# EAGLE design sfp_flase (EAGLE 9.3.2)
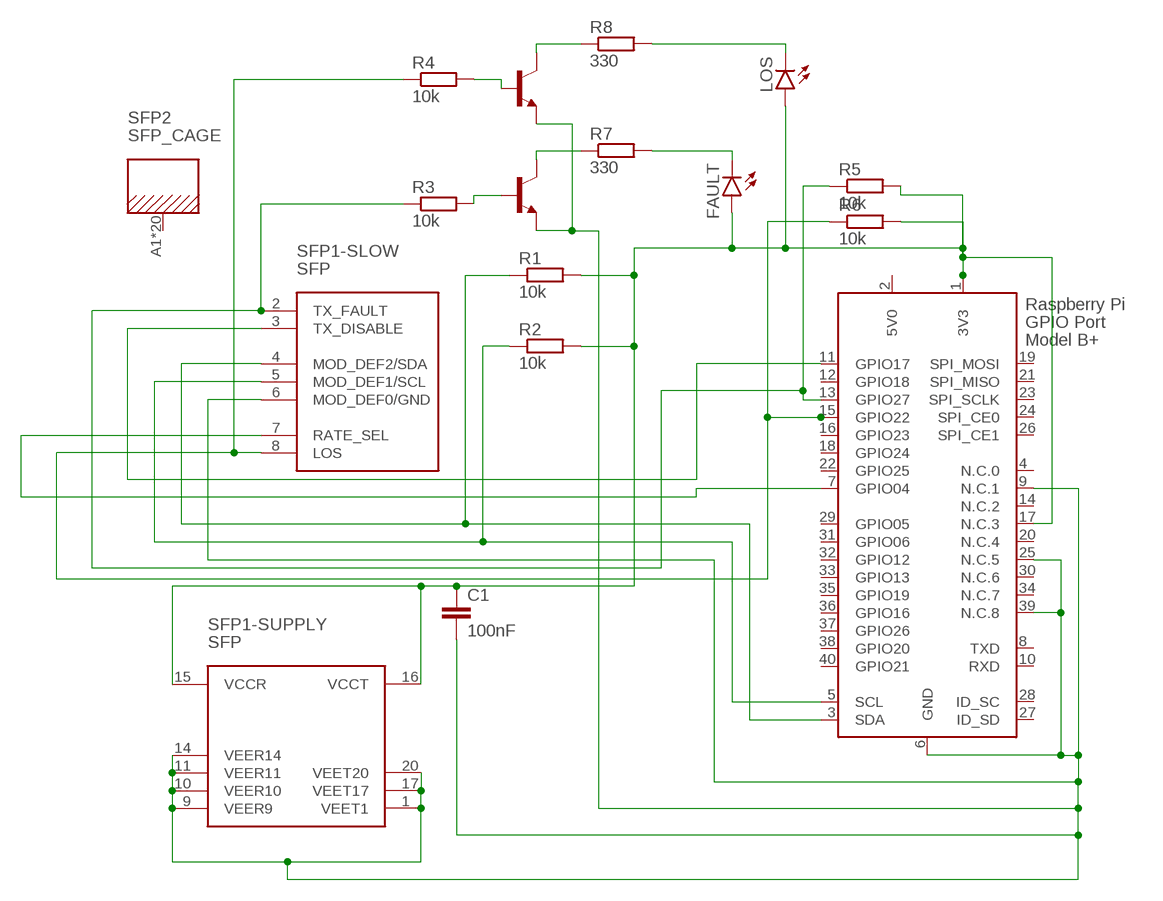
[diagram p0: schematic, sheet 1]

## Parts
C1  100nF  C-EUC1206  [C1206]
FAULT  LEDCHIPLED_1206  [CHIPLED_1206]
LOS  LEDCHIPLED_1206  [CHIPLED_1206]
R1  10k  R-EU_M1206  [M1206]
R2  10k  R-EU_M1206  [M1206]
R3  10k  R-EU_M1206  [M1206]
R4  10k  R-EU_M1206  [M1206]
R5  10k  R-EU_M1206  [M1206]
R6  10k  R-EU_M1206  [M1206]
R7  330  R-EU_M1206  [M1206]
R8  330  R-EU_M1206  [M1206]
SFP1  SFP  [SFP]
SFP2  SFP_CAGE  [SFP_CAGE]
T1  BC847  [SOT23]
T2  BC847  [SOT23]
X1  RASPI_BOARD_B+_E0  [RASPI_BOARD_B+_EDGES_0DRILL]

## Nets
3V3: C1.1 FAULT.A LOS.A R1.2 R2.2 R5.2 R6.2 SFP1.15(-SUPPLY:VCCR) SFP1.16(-SUPPLY:VCCT) X1.1(3V3) X1.17(N.C.3)
GND: C1.2 SFP1.1(-SUPPLY:VEET1) SFP1.6(-SLOW:MOD_DEF0/GND) SFP1.9(-SUPPLY:VEER9) SFP1.10(-SUPPLY:VEER10) SFP1.11(-SUPPLY:VEER11) SFP1.14(-SUPPLY:VEER14) SFP1.17(-SUPPLY:VEET17) SFP1.20(-SUPPLY:VEET20) T1.2(E) T2.2(E) X1.6(GND) X1.9(N.C.1) X1.25(N.C.5) X1.39(N.C.8)
N$1: R2.1 SFP1.5(-SLOW:MOD_DEF1/SCL) X1.5(SCL)
N$2: R1.1 SFP1.4(-SLOW:MOD_DEF2/SDA) X1.3(SDA)
N$3: R3.1 R5.1 SFP1.2(-SLOW:TX_FAULT) X1.13(GPIO27)
N$6: SFP1.3(-SLOW:TX_DISABLE) X1.11(GPIO17)
N$7: R4.2 T1.1(B)
N$8: R3.2 T2.1(B)
N$9: R8.1 T1.3(C)
N$10: R7.1 T2.3(C)
N$11: FAULT.C R7.2
N$12: LOS.C R8.2
N$14: SFP1.7(-SLOW:RATE_SEL) X1.7(GPIO04)
N$16: R4.1 R6.1 SFP1.8(-SLOW:LOS) X1.15(GPIO22)
Unconnected: SFP1.12(-HS:RD_N) SFP1.13(-HS:RD_P) SFP1.18(-HS:TD_P) SFP1.19(-HS:TD_N) X1.4(N.C.0) X1.8(TXD) X1.10(RXD) X1.12(GPIO18) X1.14(N.C.2) X1.16(GPIO23) X1.18(GPIO24) X1.19(SPI_MOSI) X1.20(N.C.4) X1.21(SPI_MISO) X1.22(GPIO25) X1.23(SPI_SCLK) X1.24(SPI_CE0) X1.26(SPI_CE1) X1.27(ID_SD) X1.28(ID_SC) X1.29(GPIO05) X1.30(N.C.6) X1.31(GPIO06) X1.32(GPIO12) X1.33(GPIO13) X1.34(N.C.7) X1.35(GPIO19) X1.36(GPIO16) X1.37(GPIO26) X1.38(GPIO20) X1.40(GPIO21)

## Power pins joined to a net without a drawn wire
5V0: X1.2(5V0)
GND: SFP2.A1(CAGE) SFP2.A2(CAGE) SFP2.A3(CAGE) SFP2.A4(CAGE) SFP2.A5(CAGE) SFP2.A6(CAGE) SFP2.A7(CAGE) SFP2.A8(CAGE) SFP2.A10(CAGE) SFP2.A11(CAGE) SFP2.A12(CAGE) SFP2.B1(CAGE) SFP2.B2(CAGE) SFP2.B3(CAGE) SFP2.B4(CAGE) SFP2.B5(CAGE) SFP2.B6(CAGE) SFP2.B7(CAGE) SFP2.B8(CAGE) SFP2.B10(CAGE)

## Library data of the parts
C1 = rcl:C-EU: CAPACITOR, European symbol; SPICEPREFIX: C
FAULT LOS = led:LED: LED OSRAM: - CHIPLED LG R971, LG N971, LY N971, LG Q971, LY Q971, LO R971, LY R971 LH N974, LH R974 LS Q976, LO Q976, LY Q976 LO Q996 - Hyper CHIPLED LW Q18S LB Q993, LB Q99A, LB R99A - SideLED LS A670, LO A670, LY A670, LG A670, LP A670 LB A673, LV A673, LT A673, LW A673 LH A674 LY A675 LS A676, LA A676, LO A676, LY A676, LW A676 LS A679, LY A679, LG A679 - Hyper Micro SIDELED® LS Y876, LA Y876, LO Y876, LY Y876 LT Y87S - SmartLED LW L88C, LW L88S LB L89C, LB L89S, LG L890 LS L89K, LO L89K, LY L89K LS L896, LA L896, LO L896, LY L896 - TOPLED LS T670, LO T670, LY T670, LG T670, LP T670 LSG T670, LSP T670, LSY T670, LOP T670, LYG T670 LG T671, LOG T671, LSG T671 LB T673, LV T673, LT T673, LW T673 LH T674 LS T676, LA T676, LO T676, LY T676, LB T676, LH T676, LSB T676, LW T676 LB T67C, LV T67C, LT T67C, LS T67K, LO T67K, LY T67K, LW E67C LS E67B, LA E67B, LO E67B, LY E67B, LB E67C, LV E67C, LT E67C LW T67C LS T679, LY T679, LG T679 LS T770, LO T770, LY T770, LG T770, LP T770 LB T773, LV T773, LT T773, LW T773 LH T774 LS E675, LA E675, LY E675, LS T675 LS T776, LA T776, LO T776, LY T776, LB T776 LHGB T686 LT T68C, LB T68C - Hyper Mini TOPLED® LB M676 - Mini TOPLED Santana® LG M470 LS M47K, LO M47K, LY M47K Source: http://www.osram.convergy.de LUXEON: - LUMILED® LXK2-PW12-R00, LXK2-PW12-S00, LXK2-PW14-U00, LXK2-PW14-V00 LXK2-PM12-R00, LXK2-PM12-S00, LXK2-PM14-U00 LXK2-PE12-Q00, LXK2-PE12-R00, LXK2-PE12-S00, LXK2-PE14-T00, LXK2-PE14-U00 LXK2-PB12-K00, LXK2-PB12-L00, LXK2-PB12-M00, LXK2-PB14-N00, LXK2-PB14-P00, LXK2-PB14-Q00 LXK2-PR12-L00, LXK2-PR12-M00, LXK2-PR14-Q00, LXK2-PR14-R00 LXK2-PD12-Q00, LXK2-PD12-R00, LXK2-PD12-S00 LXK2-PH12-R00, LXK2-PH12-S00 LXK2-PL12-P00, LXK2-PL12-Q00, LXK2-PL12-R00 Source: www.luxeon.com KINGBRIGHT: KA-3528ASYC Source: www.kingbright.com
R1-R8 = rcl:R-EU_: RESISTOR, European symbol; SPICEPREFIX: R
SFP1 = sfp:SFP: SFP receptable (Combine with SFP_CAGE for a full SFP setup)
SFP2 = sfp:SFP_CAGE: SFP Cage
T1 T2 = transistor-neu-to92:BC847: NPN TRANSISTOR
X1 = raspberrypi_bastelstube_v13:RASPI_BOARD_B+: Raspberry Pi GPIO connector with markings for the outer dimensions of the Raspberry Pi board model B+ with different sets of drill holes or mounting pads

## Board
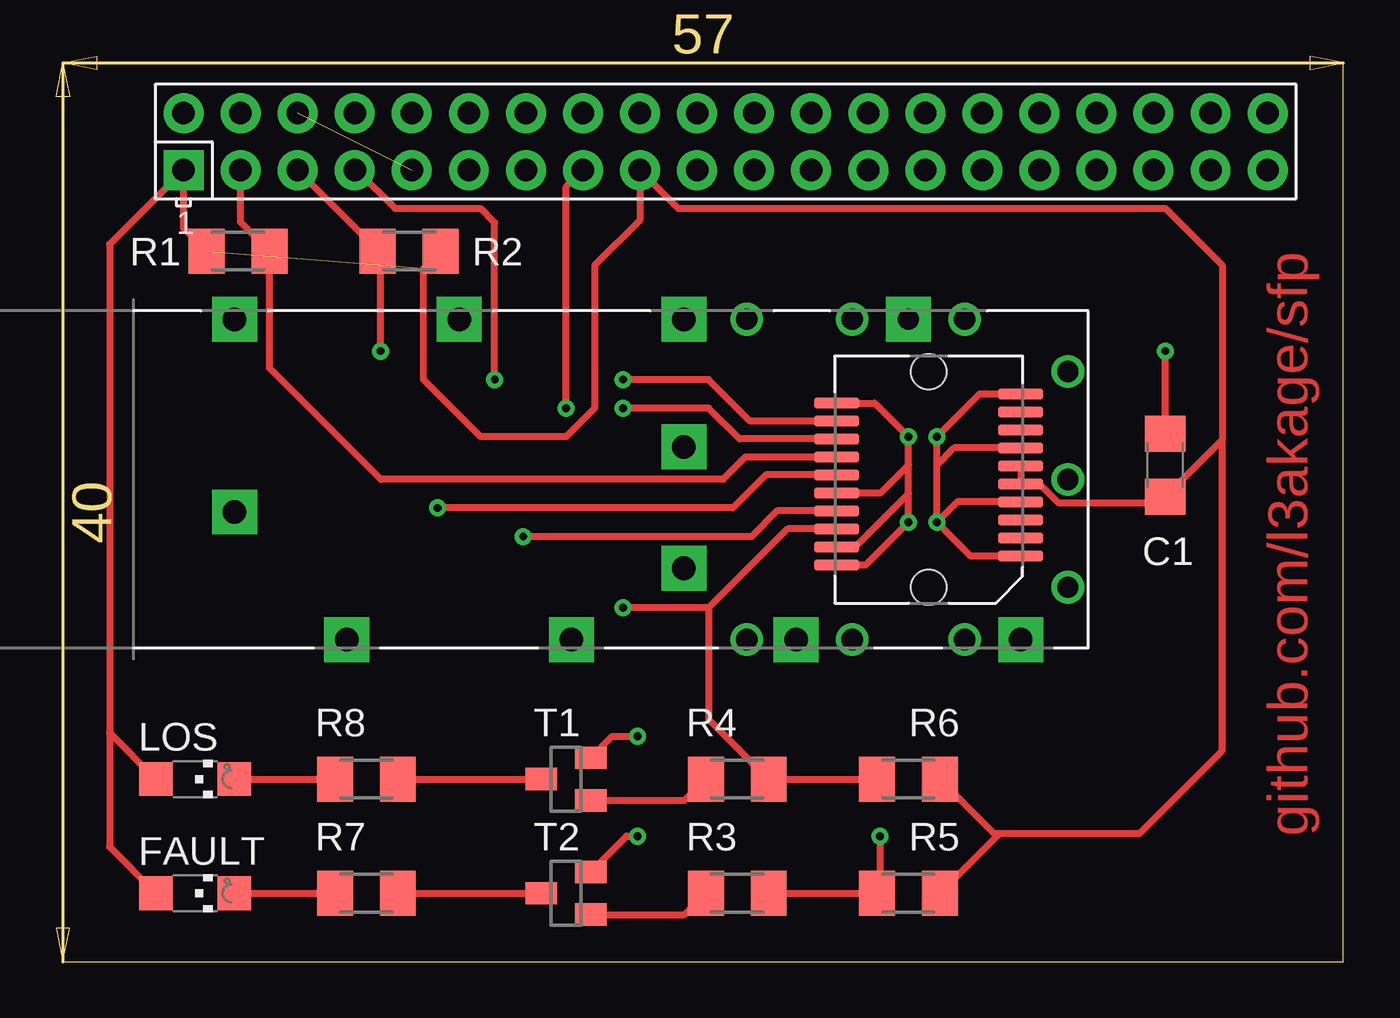
[diagram p1: board, top side]
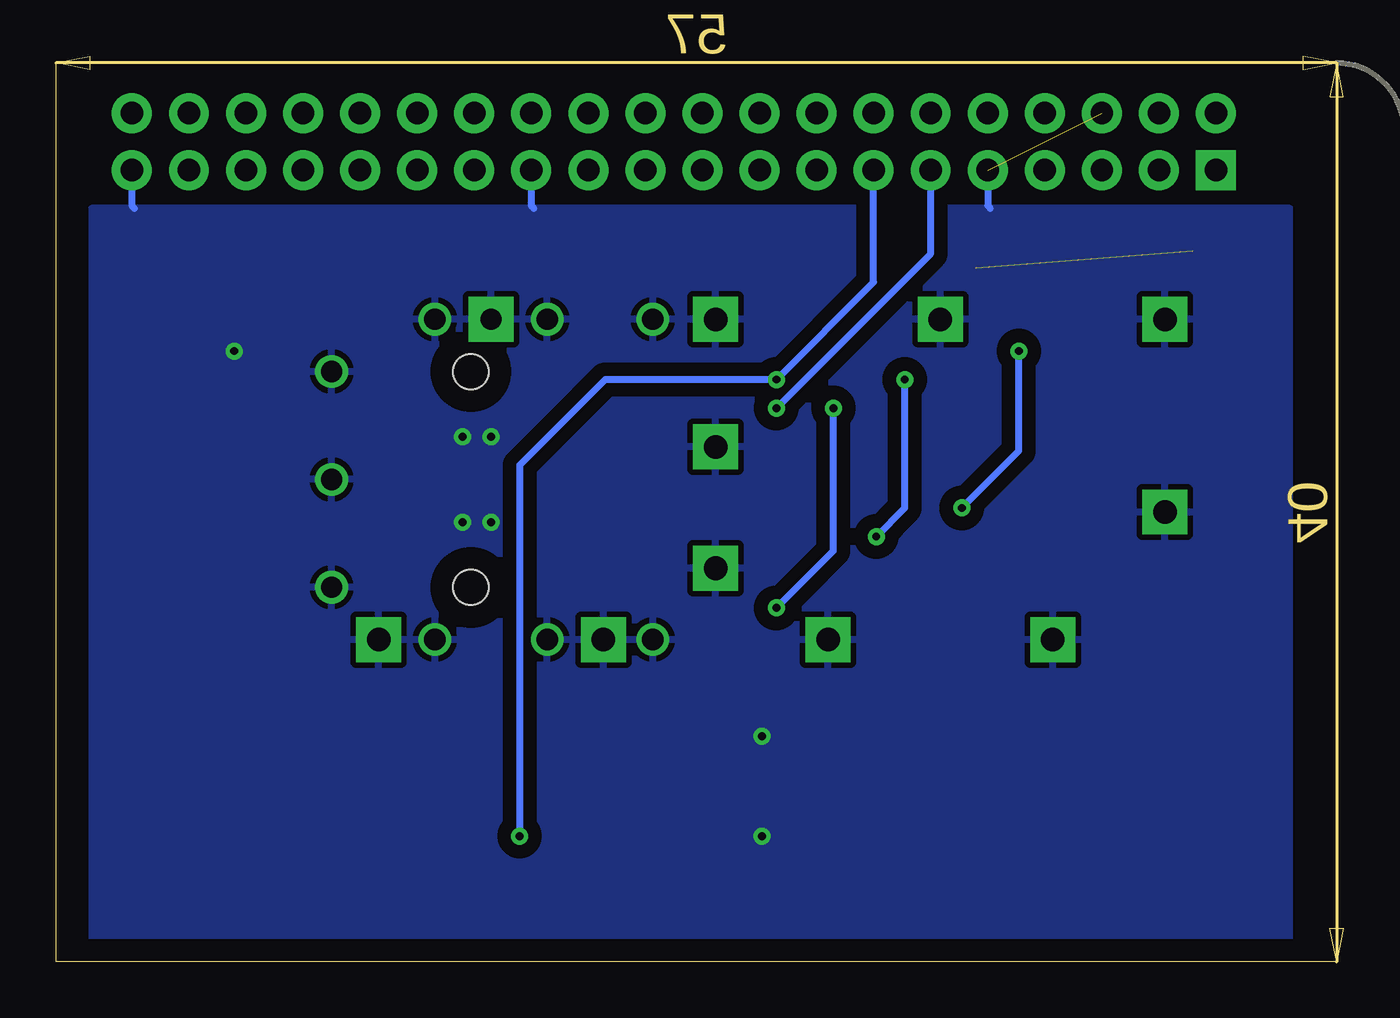
[diagram p2: board, bottom side, seen from below]

Size 57 x 40 mm. Coordinates in mm from the lower left corner, seen from the top.
Outline: 0,0 57,0 57,40 0,40 0,0
Copper layers (1*16): Top 0.035mm / dielectric 1.5mm / Bottom 0.035mm
Design rules "default": minimum track width 6mil, minimum drill 0.35mm, track to track 6mil, track to pad 6mil, pad to pad 6mil, via to via 6mil, smd to smd 6mil, copper to edge 40mil, drill to drill 6mil, minimum pad ring 10mil, minimum via ring 8mil, stop-mask expansion 4mil, vias tented up to drill 0mil, thermal gap 10mil

### Footprints (pad centres in the part's own frame; a part is rotated, then mirrored left to right if it is on the bottom)
C1206 = smd 1.6 x 1.8: 1 -1.4,0; 2 1.4,0
CHIPLED_1206 = smd 1.5 x 1.5: A 0,-1.75; C 0,1.75
M1206 = smd 1.6 x 2: 1 -1.4,0; 2 1.4,0
SFP = smd 2 x 0.5: 1 -3.2,3.4; 2 -3.2,2.6; 3 -3.2,1.8; 4 -3.2,1; 5 -3.2,0.2; 6 -3.2,-0.6; 7 -3.2,-1.4; 8 -3.2,-2.2; 9 -3.2,-3; 10 -3.2,-3.8; 11 5,-3.4; 12 5,-2.6; 13 5,-1.8; 14 5,-1; 15 5,-0.2; 16 5,0.6; 17 5,1.4; 18 5,2.2; 19 5,3; 20 5,3.8 | hole 1.55: 0.9,4.8; 0.9,-4.8
SFP_CAGE = drill 1.05 pad 2 square: A1 -30,7.125; A2 -20,7.125; A3 -10,7.125; A5 -25,-7.125; A6 -15,-7.125; A7 -5,-7.125; A8 5,-7.125; A10 -30,-1.45; A11 -10,1.45; A12 -10,-3.95 | drill 0.95 pad 2 square: A4 0,7.125 | drill 0.95: B1 -7.2,7.125; B2 -2.5,7.125; B3 2.5,7.125; B7 2.5,-7.125; B8 -2.5,-7.125; B10 -7.2,-7.125 | drill 0.95 pad 1.27: B4 7.1,4.8; B5 7.1,0; B6 7.1,-4.8
SOT23 = smd 1 x 1.4: 1 -0.95,-1.1; 2 0.95,-1.1; 3 0,1.1
RASPI_BOARD_B+_EDGES_0DRILL = drill 1 pad 1.778 square: 1 8.37,51.23 | drill 1 pad 1.778: 2 8.37,53.77; 3 10.91,51.23; 4 10.91,53.77; 5 13.45,51.23; 6 13.45,53.77; 7 15.99,51.23; 8 15.99,53.77; 9 18.53,51.23; 10 18.53,53.77; 11 21.07,51.23; 12 21.07,53.77; 13 23.61,51.23; 14 23.61,53.77; 15 26.15,51.23; 16 26.15,53.77; 17 28.69,51.23; 18 28.69,53.77; 19 31.23,51.23; 20 31.23,53.77; 21 33.77,51.23; 22 33.77,53.77; 23 36.31,51.23; 24 36.31,53.77; 25 38.85,51.23; 26 38.85,53.77; 27 41.39,51.23; 28 41.39,53.77; 29 43.93,51.23; 30 43.93,53.77; 31 46.47,51.23; 32 46.47,53.77; 33 49.01,51.23; 34 49.01,53.77; 35 51.55,51.23; 36 51.55,53.77; 37 54.09,51.23; 38 54.09,53.77; 39 56.63,51.23; 40 56.63,53.77

### Placement (x,y rotation side)
C1  49.07,22.1 90 top
FAULT  5.89,3.05 270 top
LOS  5.89,8.13 270 top
R1  7.79,31.62 180 top
R2  15.41,31.62 0 top
R3  30.02,3.05 180 top
R4  30.02,8.13 180 top
R5  37.64,3.05 0 top
R6  37.64,8.13 0 top
R7  13.51,3.05 180 top
R8  13.51,8.13 180 top
SFP1  37.64,21.47 0 top
SFP2  37.64,21.47 0 top
T1  22.4,8.13 90 top
T2  22.4,3.05 90 top
X1  -3,-16 0 top

### Tracks (layer width: path | path; a pad name or v marks a point on that pad's centre or on a via)
3V3  (1 unrouted)
  Top 0.305: 42.72,21.27 SFP1.15 | 2.08,10.19 LOS.A | 2.08,10.19 2.08,31.94 X1.1 5.37,32.65 R1.2 | 2.08,10.19 2.08,5.11 FAULT.A | 42.72,21.27 43.48,21.27 44.31,20.43 48.8,20.43 C1.1 51.61,23.24 | SFP1.16 42.64,21.34 42.72,21.27 | 51.61,23.24 51.61,30.99 49.07,33.53 27.39,33.53 X1.17 25.69,33.01 23.67,30.99 23.67,24.64 22.4,23.37 18.59,23.37 16.05,25.91 16.05,30.86 R2.2 | 51.61,23.24 51.61,9.4 47.93,5.72 43.99,5.72 41.71,5.72 | 41.45,5.46 R5.2 41.71,5.72 | 41.71,5.72 41.45,5.72 R6.2
GND  (via drill 0.35)  (1 unrouted)
  Top 0.305: T2.2 25.09,5.59 v25.57,5.59 | T1.2 24.45,10.04 v25.57,10.04 | SFP1.1 36.15,24.87 v37.64,23.37 37.64,22.1 | SFP1.6 36.41,20.87 37.64,22.1 | SFP1.9 35.27,18.47 37.64,20.83 | SFP1.10 35.74,17.66 v37.64,19.56 37.64,20.83 | 37.64,20.83 37.64,22.1 | SFP1.20 40.8,25.27 v38.91,23.37 38.91,22.1 | SFP1.17 39.67,22.87 38.91,22.1 | SFP1.14 39.81,20.47 v38.91,19.56 | v38.91,19.56 40.41,18.06 SFP1.11 | v38.91,19.56 38.91,22.1 | C1.2 v49.07,27.18
  Bottom 0.305: X1.9 15.53,33.65 15.41,33.53 | X1.25 35.85,33.65 35.73,33.53 | X1.39 53.63,33.65 53.52,33.53
  pour Bottom (isolate 0.61): 2.08,33.53 55.42,33.53 55.42,0.51 2.08,0.51
N$1  (via drill 0.35)
  Top 0.305: X1.5 14.02,31.66 | 14.02,31.66 R2.1 | SFP1.5 31.29,21.66 29.82,20.2 v16.68,20.2 | v14.14,27.18 14.14,31.53 14.02,31.66
  Bottom 0.305: v14.14,27.18 14.14,22.73 v16.68,20.2
N$2
  Top 0.305: SFP1.4 30.38,22.47 29.38,21.47 14.14,21.47 9.2,26.41 R1.1 7.91,32.91 X1.3
N$3  (via drill 0.35)
  Top 0.305: R3.1 R5.1 36.37,3.18 v36.37,5.59 | SFP1.2 30.59,24.06 28.75,25.91 v24.94,25.91
  Bottom 0.305: X1.13 20.61,30.24 v24.94,25.91 32.56,25.91 36.37,22.1 v36.37,5.59
N$6  (via drill 0.35)
  Top 0.305: SFP1.3 30.12,23.27 28.75,24.64 v24.94,24.64
  Bottom 0.305: v24.94,24.64 18.07,31.51 X1.11
N$7
  Top 0.305: T1.1 27.67,7.18 R4.2
N$8
  Top 0.305: T2.1 27.67,2.1 R3.2
N$9
  Top 0.305: R8.1 T1.3
N$10
  Top 0.305: R7.1 T2.3
N$11
  Top 0.305: FAULT.C R7.2
N$12
  Top 0.305: LOS.C R8.2
N$14  (via drill 0.35)
  Top 0.305: X1.7 13.08,35.23 14.78,33.53 18.59,33.53 19.23,32.9 v19.23,25.91 | SFP1.7 31.8,20.06 30.66,18.92 v20.5,18.92
  Bottom 0.305: v20.5,18.92 19.23,20.2 v19.23,25.91
N$16  (via drill 0.35)
  Top 0.305: R6.1 R4.1 28.75,10.8 28.75,15.75 | SFP1.8 32.27,19.27 28.75,15.75 | X1.15 22.4,34.48 v22.4,24.64 | 28.75,15.75 v24.94,15.75
  Bottom 0.305: v24.94,15.75 22.4,18.29 v22.4,24.64

### Text on the board
Top: github.com/l3akage/sfp